# Altium schematic sheet SimpleNode2.SchDoc
size A4
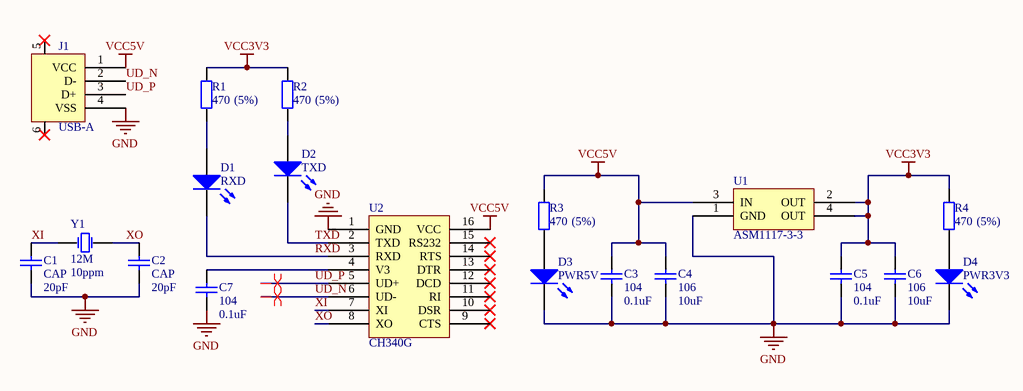
[diagram p0: SimpleNode2.SchDoc]

## Parts
C1  CAP  value 20pF  [C0603]
C2  CAP  value 20pF  [C0603]
C3  104  value 0.1uF  [C0603]
C4  106  value 10uF  [C0603]
C5  104  value 0.1uF  [C0603]
C6  106  value 10uF  [C0603]
C7  104  value 0.1uF  [C0603]
D1  RXD  [LED0603]
D2  TXD  [LED0603]
D3  PWR5V  [LED0603]
D4  PWR3V3  [LED0603]
J1  USB-A  [USB-A 公头]
R1  470  value (5%)  [R0603]
R2  470  value (5%)  [R0603]
R3  470  value (5%)  [R0603]
R4  470  value (5%)  [R0603]
U1  ASM1117-3-3  [SOT-223]
U2  CH340G  [SOP16]
Y1  12M  value 10ppm  [HC-49S]

## Nets
GND: C1.1 C2.1 C3.1 C4.1 C5.1 C6.1 C7.1 D3.2(K) D4.2(K) J1.4(VSS) U1.1(GND) U2.1(GND)
VCC3V3: C5.2 C6.2 R1.2 R2.2 R4.2 U1.2(OUT) U1.4(OUT)
VCC5V: C3.2 C4.2 J1.1(VCC) R3.2 U1.3(IN) U2.16(VCC)
RXD: D1.2(K) U2.3(RXD)
TXD: D2.2(K) U2.2(TXD)
UD_N: J1.2(D-) U2.6(UD-)
UD_P: J1.3(D+) U2.5(UD+)
XI: C1.2 U2.7(XI) Y1.1(OSC1)
XO: C2.2 U2.8(XO) Y1.2(OSC2)
NetC7_2: C7.2 U2.4(V3)
NetD1_1: D1.1(A) R1.1
NetD2_1: D2.1(A) R2.1
NetD3_1: D3.1(A) R3.1
NetD4_1: D4.1(A) R4.1

Not connected (* = marked no-connect by the designer): J1 5* 6*; U2 9(CTS)* 10(DSR)* 11(RI)* 12(DCD)* 13(DTR)* 14(RTS)* 15(RS232)*

## Layout directives
differential pair: UD_N, UD_P

## Library data of the parts
C1-C7 = 贴片无极性电容
D1-D4 = 贴片发光二级管
J1 = USB-A 公头
R1-R4 = 贴片电阻
U1 = ASM1117-3-3: 贴片5V转3.3V芯片
U2 = CH340G: 贴片USB转TTL
Y1 = 直插无源晶振